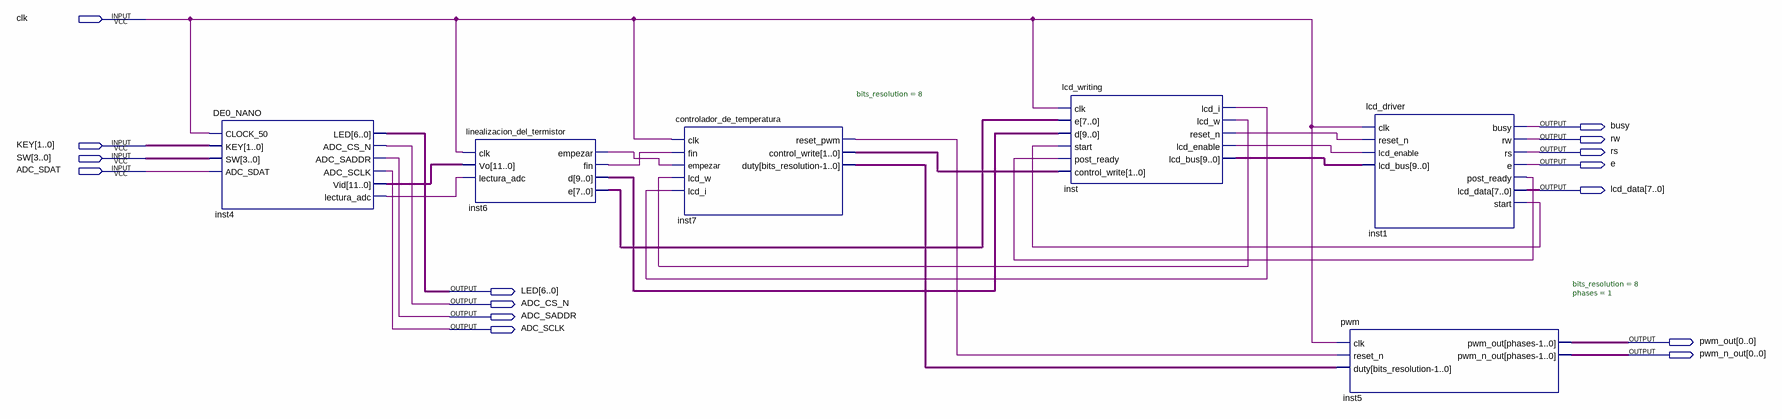
[diagram p0: schematic sheet]
// Quartus schematic sistema_de_control_de_temperatura.bdf as structural Verilog: 6 symbols, 15 pins
module sistema_de_control_de_temperatura (
  input  clk,
  input  [1:0] KEY,
  input  [3:0] SW,
  input  ADC_SDAT,
  output busy,
  output rw,
  output rs,
  output e,
  output [7:0] lcd_data,
  output [6:0] LED,
  output ADC_CS_N,
  output ADC_SADDR,
  output ADC_SCLK,
  output [0:0] pwm_out,
  output [0:0] pwm_n_out
);

  wire inst1_post_ready, inst1_start, inst4_lectura_adc, inst6_empezar, inst6_fin, inst7_reset_pwm,
       inst_lcd_enable, inst_lcd_i, inst_lcd_w, inst_reset_n;
  wire [1:0] inst7_control_write;
  wire [7:0] inst6_e, inst7_duty;
  wire [9:0] inst6_d, inst_lcd_bus;
  wire [11:0] inst4_vid;

  DE0_NANO inst4 (
    .CLOCK_50(clk), .KEY(KEY), .SW(SW), .ADC_SDAT(ADC_SDAT), .LED(LED), .ADC_CS_N(ADC_CS_N),
    .ADC_SADDR(ADC_SADDR), .ADC_SCLK(ADC_SCLK), .Vid(inst4_vid), .lectura_adc(inst4_lectura_adc));
  linealizacion_del_termistor inst6 (
    .clk(clk), .Vo(inst4_vid), .lectura_adc(inst4_lectura_adc), .empezar(inst6_empezar), .fin(inst6_fin),
    .d(inst6_d), .e(inst6_e));
  controlador_de_temperatura #(.bits_resolution(8)) inst7 (
    .clk(clk), .fin(inst6_fin), .empezar(inst6_empezar), .lcd_w(inst_lcd_w), .lcd_i(inst_lcd_i),
    .reset_pwm(inst7_reset_pwm), .control_write(inst7_control_write), .duty(inst7_duty));
  lcd_writing inst (
    .clk(clk), .e(inst6_e), .d(inst6_d), .start(inst1_start), .post_ready(inst1_post_ready),
    .control_write(inst7_control_write), .lcd_i(inst_lcd_i), .lcd_w(inst_lcd_w), .reset_n(inst_reset_n),
    .lcd_enable(inst_lcd_enable), .lcd_bus(inst_lcd_bus));
  pwm #(.bits_resolution(8), .phases(1)) inst5 (
    .clk(clk), .reset_n(inst7_reset_pwm), .duty(inst7_duty), .pwm_out(pwm_out[0]), .pwm_n_out(pwm_n_out[0]));
  lcd_driver inst1 (
    .clk(clk), .reset_n(inst_reset_n), .lcd_enable(inst_lcd_enable), .lcd_bus(inst_lcd_bus), .busy(busy),
    .rw(rw), .rs(rs), .e(e), .post_ready(inst1_post_ready), .lcd_data(lcd_data), .start(inst1_start));
endmodule
